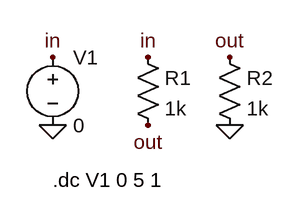
[diagram p0: schematic div_dc.asc]
div_dc.asc, the LTspice schematic file:
Version 4
SHEET 1 880 680
FLAG 0 16 in
FLAG 0 96 0
FLAG 112 16 in
FLAG 112 96 out
FLAG 208 16 out
FLAG 208 96 0
SYMBOL voltage 0 0 R0
SYMATTR InstName V1
SYMATTR Value 0
SYMBOL res 96 0 R0
SYMATTR InstName R1
SYMATTR Value 1k
SYMBOL res 192 0 R0
SYMATTR InstName R2
SYMATTR Value 1k
TEXT 0 160 Left 2 !.dc V1 0 5 1

The netlist it stands for:
* div_dc.asc
V1 in 0 0
R1 in out 1k
R2 out 0 1k
.dc V1 0 5 1
.backanno
.end